# EAGLE design Mug Temperature Sensor (EAGLE 5.11)
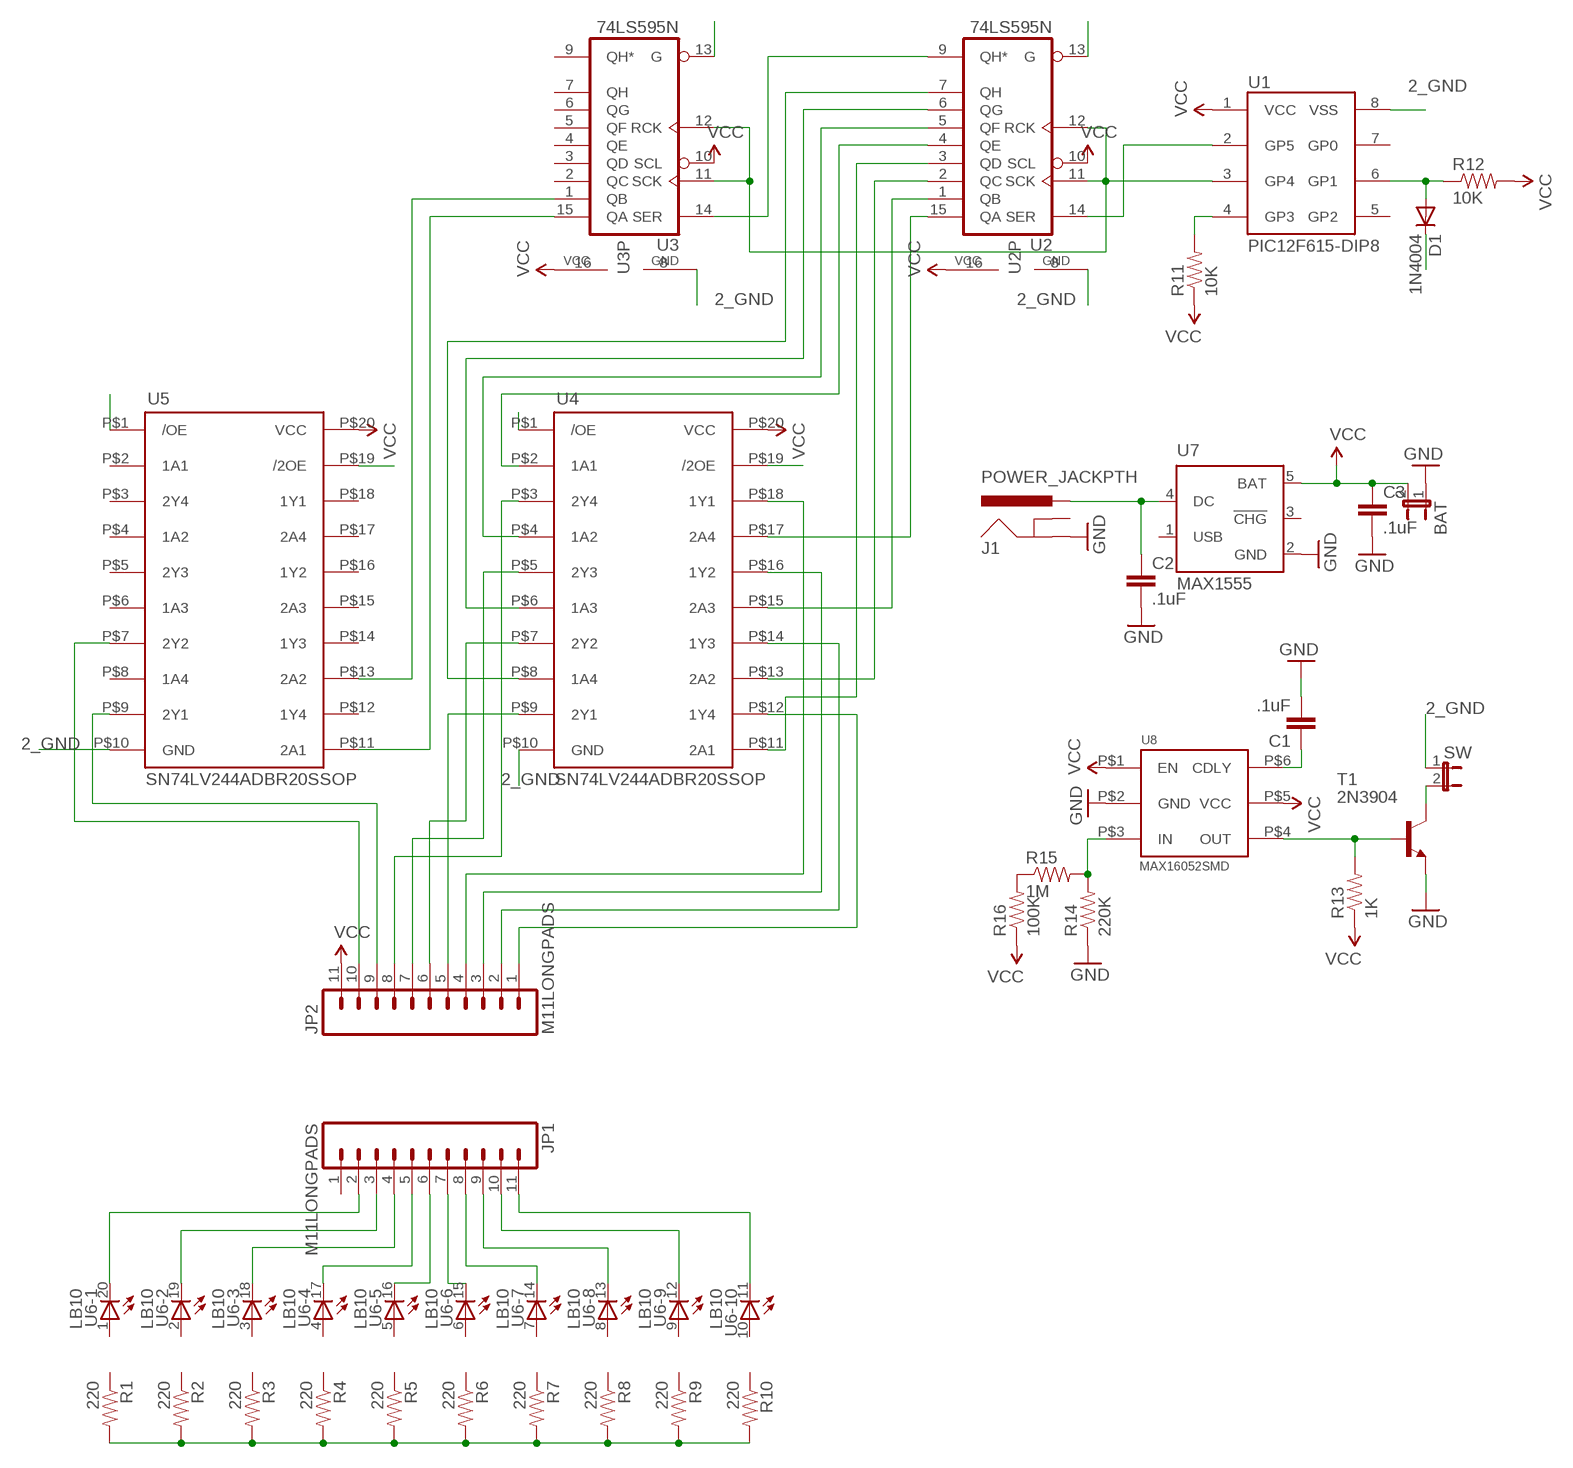
[diagram p0: schematic, sheet 1]

## Parts
BAT  JUMPER-2PTH  [1X02]
C1  .1uF  CAPPTH  [CAP-PTH-SMALL]
C2  .1uF  CAPPTH  [CAP-PTH-SMALL]
C3  .1uF  CAPPTH  [CAP-PTH-SMALL]
D1  1N4004  [DO41-10]
J1  POWER_JACKPTH  [POWER_JACK_PTH]
JP1  M11LONGPADS  [1X11_LONGPADS]
JP2  M11LONGPADS  [1X11_LONGPADS]
R1  220  RESISTORPTH-1/4W  [AXIAL-0.4]
R2  220  RESISTORPTH-1/4W  [AXIAL-0.4]
R3  220  RESISTORPTH-1/4W  [AXIAL-0.4]
R4  220  RESISTORPTH-1/4W  [AXIAL-0.4]
R5  220  RESISTORPTH-1/4W  [AXIAL-0.4]
R6  220  RESISTORPTH-1/4W  [AXIAL-0.4]
R7  220  RESISTORPTH-1/4W  [AXIAL-0.4]
R8  220  RESISTORPTH-1/4W  [AXIAL-0.4]
R9  220  RESISTORPTH-1/4W  [AXIAL-0.4]
R10  220  RESISTORPTH-1/4W  [AXIAL-0.4]
R11  10K  RESISTORPTH-1/4W  [AXIAL-0.4]
R12  10K  RESISTORPTH-1/4W  [AXIAL-0.4]
R13  1K  RESISTORPTH-1/4W  [AXIAL-0.4]
R14  220K  RESISTORPTH-1/4W  [AXIAL-0.4]
R15  1M  RESISTORPTH-1/4W  [AXIAL-0.4]
R16  100K  RESISTORPTH-1/4W  [AXIAL-0.4]
SW  JUMPER-2PTH  [1X02]
T1  2N3904  [TO92]
U1  PIC12F615-DIP8  [DIP-8-300]
U2  74LS595N  [DIL16]
U3  74LS595N  [DIL16]
U4  SN74LV244ADBR20SSOP  [20-SSOP]
U5  SN74LV244ADBR20SSOP  [20-SSOP]
U6  LB10  [LB10]
U7  MAX1555  [SOT23-5L]
U8  MAX16052SMD  [6-SOT23]

## Nets
2_GND: D1.C SW.1 U1.8(VSS) U2.8(GND) U2.13(G) U3.8(GND) U3.13(G) U4.P$1(/OE) U4.P$10(GND) U4.P$19(/2OE) U5.P$1(/OE) U5.P$10(GND) U5.P$19(/2OE)
GND: BAT.1 C1.2 C2.2 C3.2 J1.GND R14.P$1 T1.3(E) U7.2(GND) U8.P$2(GND)
N$1: U1.3(GP4) U2.11(SCK) U2.12(RCK) U3.11(SCK) U3.12(RCK)
N$2: U1.2(GP5) U2.14(SER)
N$3: U2.9(QH*) U3.14(SER)
N$5: U2.15(QA) U4.P$17(2A4)
N$6: U2.1(QB) U4.P$15(2A3)
N$7: U2.2(QC) U4.P$13(2A2)
N$8: U2.3(QD) U4.P$11(2A1)
N$9: U2.4(QE) U4.P$2(1A1)
N$10: U2.5(QF) U4.P$4(1A2)
N$11: U2.6(QG) U4.P$6(1A3)
N$12: U2.7(QH) U4.P$8(1A4)
N$13: U3.15(QA) U5.P$11(2A1)
N$23: JP2.5 U4.P$9(2Y1)
N$24: U3.1(QB) U5.P$13(2A2)
N$25: JP2.6 U4.P$7(2Y2)
N$26: JP2.7 U4.P$5(2Y3)
N$27: JP2.8 U4.P$3(2Y4)
N$28: JP2.4 U4.P$18(1Y1)
N$29: JP2.3 U4.P$16(1Y2)
N$30: JP2.2 U4.P$14(1Y3)
N$31: JP2.1 U4.P$12(1Y4)
N$32: JP2.9 U5.P$9(2Y1)
N$33: JP2.10 U5.P$7(2Y2)
N$34: R11.P$2 U1.4(GP3)
N$35: D1.A R12.P$1 U1.6(GP1)
N$36: C2.1 J1.PWR U7.4(DC)
N$37: R13.P$2 T1.2(B) U8.P$4(OUT)
N$38: C1.1 U8.P$6(CDLY)
N$39: R14.P$2 R15.P$2 U8.P$3(IN)
N$40: R15.P$1 R16.P$2
N$41: SW.2 T1.1(C)
N$42: R1.P$2 R2.P$2 R3.P$2 R4.P$2 R5.P$2 R6.P$2 R7.P$2 R8.P$2 R9.P$2 R10.P$2
N$43: JP1.2 U6.20(-1:C)
N$44: JP1.3 U6.19(-2:C)
N$45: JP1.4 U6.18(-3:C)
N$46: JP1.5 U6.17(-4:C)
N$47: JP1.6 U6.16(-5:C)
N$48: JP1.7 U6.15(-6:C)
N$49: JP1.8 U6.14(-7:C)
N$50: JP1.9 U6.13(-8:C)
N$51: JP1.10 U6.12(-9:C)
N$52: JP1.11 U6.11(-10:C)
VCC: BAT.2 C3.1 JP2.11 R11.P$1 R12.P$2 R13.P$1 R16.P$1 U1.1(VCC) U2.10(SCL) U2.16(VCC) U3.10(SCL) U3.16(VCC) U4.P$20(VCC) U5.P$20(VCC) U7.5(BAT) U8.P$1(EN) U8.P$5(VCC)
Unconnected: J1.GNDBREAK JP1.1 R1.P$1 R2.P$1 R3.P$1 R4.P$1 R5.P$1 R6.P$1 R7.P$1 R8.P$1 R9.P$1 R10.P$1 U1.5(GP2) U1.7(GP0) U3.2(QC) U3.3(QD) U3.4(QE) U3.5(QF) U3.6(QG) U3.7(QH) U3.9(QH*) U5.P$2(1A1) U5.P$3(2Y4) U5.P$4(1A2) U5.P$5(2Y3) U5.P$6(1A3) U5.P$8(1A4) U5.P$12(1Y4) U5.P$14(1Y3) U5.P$15(2A3) U5.P$16(1Y2) U5.P$17(2A4) U5.P$18(1Y1) U6.1(-1:A) U6.2(-2:A) U6.3(-3:A) U6.4(-4:A) U6.5(-5:A) U6.6(-6:A) U6.7(-7:A) U6.8(-8:A) U6.9(-9:A) U6.10(-10:A) U7.1(USB) U7.3(!CHG)

## Library data of the parts
BAT SW = SparkFun:JUMPER-2: Jumper Basic 0.1" spaced jumper. Use with breakaway headers.
C1-C3 = SparkFun:CAP: Capacitor Standard 0603 ceramic capacitor, and 0.1" leaded capacitor.
D1 = diode:1N4004: DIODE general purpose rectifier, 1 A
J1 = SparkFun:POWER_JACK: Power Jack This is the standard 5.5mm barrel jack for power. The PTH is the most common, proven, reliable, footprint. All others are experimental. The Slot footprint only works if the mill layer is transmitted to the PCB fab house so be warned. Spark Fun Electronics SKU : PRT-00119. Mating wall wart : TOL-00298 (and others)
JP1 JP2 = SparkFun:M11: Header 11 Standard 11-pin 0.1" header. Use with straight break away headers (SKU : PRT-00116), right angle break away headers (PRT-00553), swiss pins (PRT-00743), machine pins (PRT-00117), and female headers (PRT-00115).
R1-R16 = SparkFun:RESISTOR: Resistor Basic schematic elements and footprints for 0603, 1206, and PTH resistors.
T1 = transistor:2N3904: NPN TRANSISTOR
U1 = boztalay_custom:PIC12F615
U2 U3 = 74xx-us:74*595: 8-bit SHIFT REGISTER, output latch
U4 U5 = boztalay_custom:SN74LV244ADBR
U6 = led:LB10: LED BLOCK 10-LED bar graph, DIL, Siemens
U7 = maxim:MAX1555: Dual-Input USB/AC Adapter 1-Cell Li+ Battery Chargers Source: http://www.maxim-ic.com .. MAX1551-MAX1555.pdf; MF: MAXIM; MPN: MAX1555EZK+T; OC_FARNELL: 1628222; OC_NEWARK: 59J2761
U8 = boztalay_custom:MAX16052

## Board
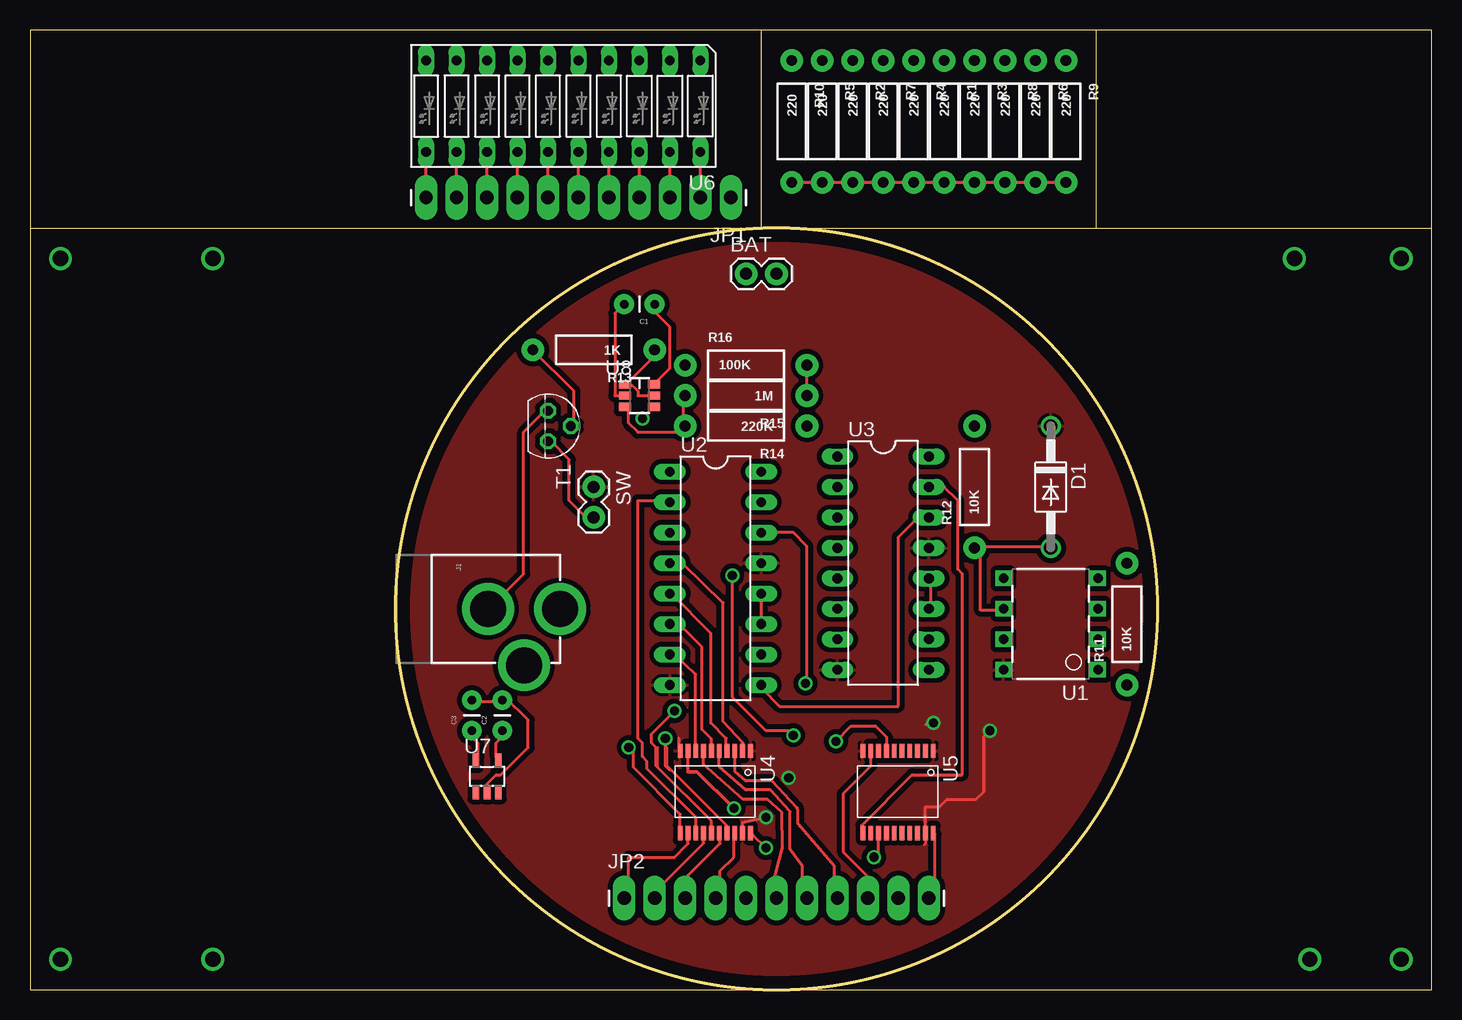
[diagram p1: board, top side]
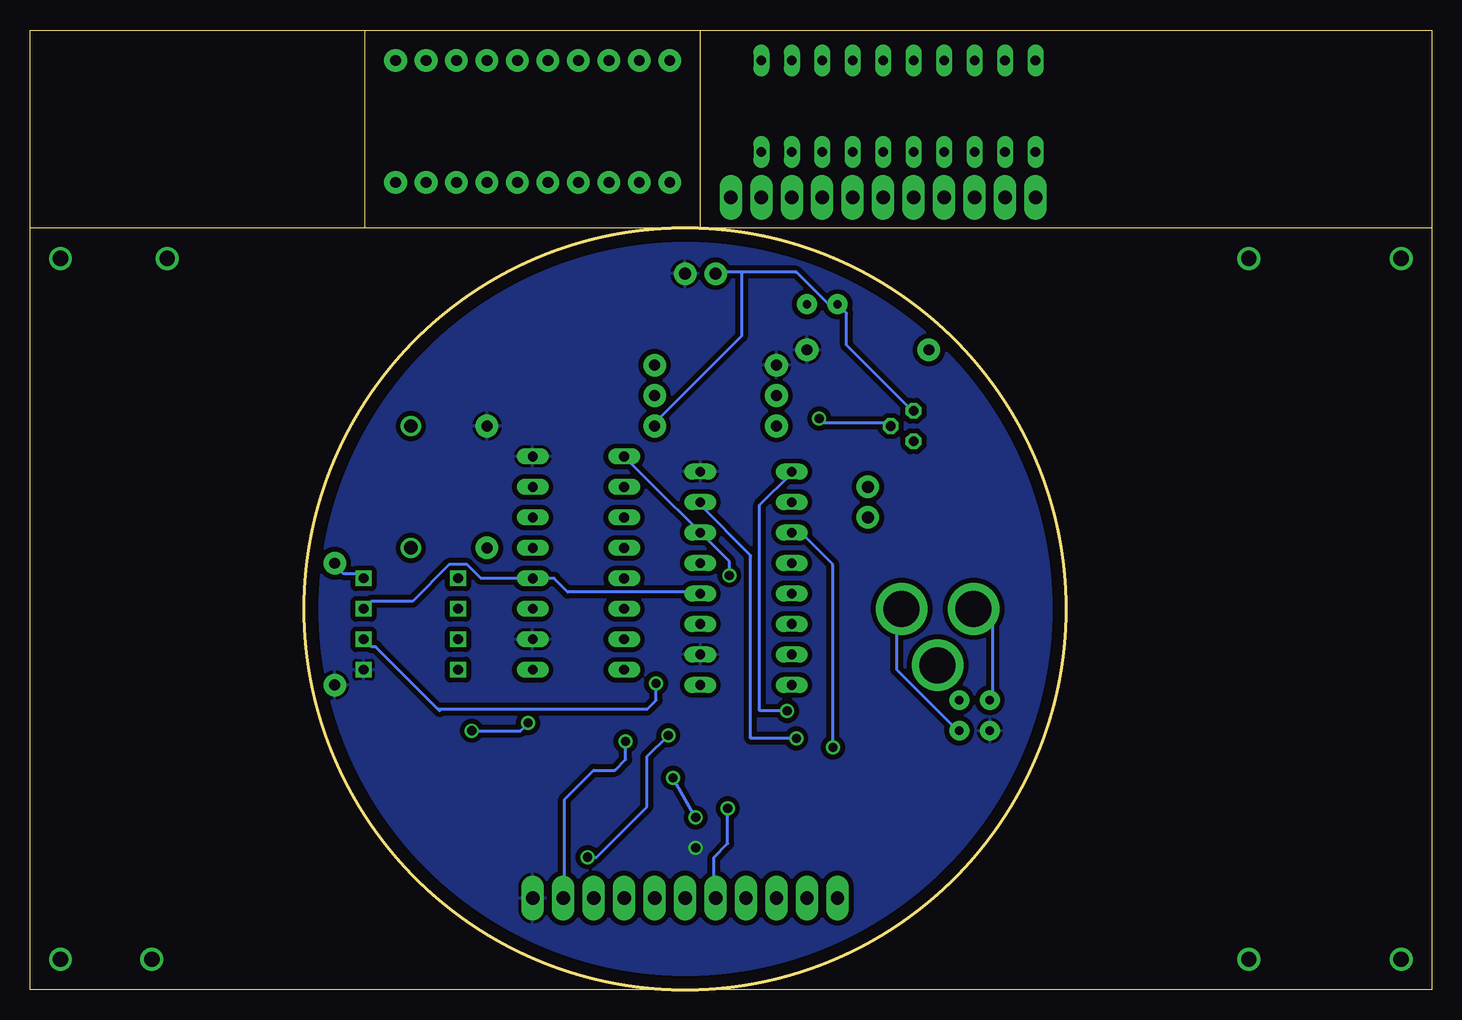
[diagram p2: board, bottom side, seen from below]

Size 116.84 x 80.01 mm. Coordinates in mm from the lower left corner, seen from the top.
Outline: 116.84,63.5 116.84,0 0,0 0,63.5
Outline: 116.84,63.5 116.84,80.01 0,80 0,63.5
Outline: 0,63.5 60.96,63.5
Outline: 60.96,63.5 88.9,63.5
Outline: 88.9,63.5 88.9,80.01
Outline: 60.96,63.5 60.96,80.01
Outline: 88.9,63.5 116.84,63.5
Outline: circle at 62.23,31.75 radius 31.75
Copper layers (1*16): Top 0.035mm / dielectric 1.5mm / Bottom 0.035mm
Design rules "default": minimum track width 10mil, minimum drill 24mil, track to track 8mil, track to pad 8mil, pad to pad 8mil, via to via 8mil, smd to smd 8mil, copper to edge 40mil, drill to drill 8mil, minimum pad ring 10mil, minimum via ring 8mil, stop-mask expansion 4mil, vias tented up to drill 0mil, thermal gap 10mil

### Footprints (pad centres in the part's own frame; a part is rotated, then mirrored left to right if it is on the bottom)
1X02 = drill 1.016 pad 1.88 round: 1 0,0; 2 2.54,0
CAP-PTH-SMALL = drill 0.7 pad 1.651 round: 1 0,0; 2 2.54,0
DO41-10 = drill 1.118 round: A 5.08,0; C -5.08,0
POWER_JACK_PTH = drill 2.997 pad 4.318 round: GND 0,7.7; GNDBREAK 4.7,10.7; PWR 0,13.7
1X11_LONGPADS = drill 1.118 pad 1.88 long: 1 0,0; 2 2.54,0; 3 5.08,0; 4 7.62,0; 5 10.16,0; 6 12.7,0; 7 15.24,0; 8 17.78,0; 9 20.32,0; 10 22.86,0; 11 25.4,0
AXIAL-0.4 = drill 0.9 pad 1.88 round: P$1 -5.08,0; P$2 5.08,0
TO92 = drill 0.813 octagon: 1 1.27,0; 2 0,1.905; 3 -1.27,0
DIP-8-300 = drill 0.8 square: 1 -3.937,3.81; 2 -3.937,1.27; 3 -3.937,-1.27; 4 -3.937,-3.81; 5 3.937,-3.81; 6 3.937,-1.27; 7 3.937,1.27; 8 3.937,3.81
DIL16 = drill 0.813 long: 1 -8.89,-3.81; 2 -6.35,-3.81; 3 -3.81,-3.81; 4 -1.27,-3.81; 5 1.27,-3.81; 6 3.81,-3.81; 7 6.35,-3.81; 8 8.89,-3.81; 9 8.89,3.81; 10 6.35,3.81; 11 3.81,3.81; 12 1.27,3.81; 13 -1.27,3.81; 14 -3.81,3.81; 15 -6.35,3.81; 16 -8.89,3.81
20-SSOP = smd 1.2 x 0.4: P$1 -3.4,2.9; P$2 -3.4,2.25; P$3 -3.4,1.6; P$4 -3.4,0.95; P$5 -3.4,0.3; P$6 -3.4,-0.35; P$7 -3.4,-1; P$8 -3.4,-1.65; P$9 -3.4,-2.3; P$10 -3.4,-2.95; P$11 3.45,-2.95; P$12 3.45,-2.3; P$13 3.45,-1.65; P$14 3.45,-1; P$15 3.45,-0.35; P$16 3.45,0.3; P$17 3.45,0.95; P$18 3.45,1.6; P$19 3.45,2.25; P$20 3.45,2.9
LB10 = drill 0.813 long: 1 -11.43,-3.81; 2 -8.89,-3.81; 3 -6.35,-3.81; 4 -3.81,-3.81; 5 -1.27,-3.81; 6 1.27,-3.81; 7 3.81,-3.81; 8 6.35,-3.81; 9 8.89,-3.81; 10 11.43,-3.81; 11 11.43,3.81; 12 8.89,3.81; 13 6.35,3.81; 14 3.81,3.81; 15 1.27,3.81; 16 -1.27,3.81; 17 -3.81,3.81; 18 -6.35,3.81; 19 -8.89,3.81; 20 -11.43,3.81
SOT23-5L = smd 0.55 x 1.2: 1 -0.95,-1.3; 2 0,-1.3; 3 0.95,-1.3; 4 0.95,1.3; 5 -0.95,1.3
6-SOT23 = smd 1 x 0.7: P$1 -1.2,0.95; P$2 -1.2,0; P$3 -1.2,-0.95; P$4 1.2,-0.95; P$5 1.2,0; P$6 1.2,0.95

### Placement (x,y rotation side)
BAT  59.69,59.69 0 top
C1  52.07,57.15 180 top
C2  39.37,21.59 90 top
C3  36.83,21.59 90 top
D1  85.09,41.91 270 top
J1  30.48,31.75 270 top
JP1  58.42,66.04 180 top
JP2  49.53,7.62 0 top
R1  76.2,72.39 270 top
R2  68.58,72.39 270 top
R3  78.74,72.39 270 top
R4  73.66,72.39 270 top
R5  66.04,72.39 270 top
R6  83.82,72.39 270 top
R7  71.12,72.39 270 top
R8  81.28,72.39 270 top
R9  86.36,72.39 270 top
R10  63.5,72.39 270 top
R11  91.44,30.48 90 top
R12  78.74,41.91 90 top
R13  46.99,53.34 180 top
R14  59.69,46.99 180 top
R15  59.69,49.53 180 top
R16  59.69,52.07 0 top
SW  46.99,41.91 270 top
T1  43.18,46.99 270 top
U1  85.09,30.48 180 top
U2  57.15,34.29 270 top
U3  71.12,35.56 270 top
U4  57.15,16.51 270 top
U5  72.39,16.51 270 top
U6  44.45,73.66 180 top
U7  38.1,17.78 0 top
U8  50.8,49.53 0 top

### Tracks (layer width: path | path; a pad name or v marks a point on that pad's centre or on a via)
2_GND  (via drill 0.76)
  Top 0.254: 59.44,12.95 U4.P$19 59.4,13.93 v61.34,14.35 | 74.56,12.08 74.68,12.19 74.68,12.95 U5.P$19 74.64,15.2 74.68,15.24 75.82,15.24 76.45,15.88 78.87,15.88 79.5,16.51 79.5,21.08 v80.01,21.59 | 54.1,20.95 54.1,20.19 U4.P$10 | v75.31,22.23 74.8,22.23 74.68,22.1 | v63.25,17.65 63.37,17.65 63.5,17.78 63.37,17.78 v63.25,17.65
  Bottom 0.254: v61.34,14.35 v63.25,17.65 | v80.01,21.59 75.95,21.59 v75.31,22.23
  pour Top (isolate 0.406): 30.48,63.5 93.98,63.5 93.98,0 30.48,0
GND
  Top 0.254: U7.2 38.1,17.14 38.86,17.91 39.24,17.91 41.53,20.19 41.53,22.48 39.62,24.38 C2.2 39.24,24 36.96,24 C3.2 | C1.2 48.77,56.39 48.77,49.53 U8.P$2 | J1.GND 38.48,32 41.15,34.67 41.15,46.48 43.05,48.39 T1.3
  Bottom 0.254: C3.2 36.58,24.38 36.58,31.62 38.1,31.62 J1.GND | T1.3 43.43,48.39 48.77,53.72 48.77,56.39 C1.2 50.29,57.15 52.96,59.82 57.53,59.82 | 57.53,59.82 59.44,59.82 BAT.1 | 57.53,59.82 57.53,54.48 64.77,47.24 R14.P$1
N$1
  Top 0.254: U2.11 U2.12 | U3.11 75.06,32 75.06,34.29 U3.12
  Bottom 0.254: U1.3 88.39,32.38 84.96,32.38 81.92,35.43 80.39,35.43 79.25,34.29 U3.12 73.15,34.29 72.01,33.15 60.96,33.15 U2.12
N$2  (via drill 0.76)
  Top 0.254: U2.14 63.63,38.1 64.77,36.96 64.77,25.65 v64.64,25.53
  Bottom 0.254: 82.8,23.37 82.68,23.24 | U1.2 88.39,28.57 88.01,28.57 82.8,23.37 | v64.64,25.53 64.64,24.13 65.41,23.37 82.8,23.37
N$3
  Top 0.254: U2.9 60.96,25.15 62.48,23.62 72.39,23.62 72.39,37.72 73.91,39.24 74.68,39.24 U3.14
N$4  (via drill 1.27)
  other vias: 2.54,2.54
N$5  (via drill 0.76)
  Top 0.254: U4.P$17 58.1,13.65 53.4,18.35 | 53.4,18.35 53.09,18.67 53.09,20.19 | v52.96,20.95 52.96,18.67 53.34,18.29 53.4,18.35
  Bottom 0.254: v52.96,20.95 56.77,20.95 56.77,36.2 60.96,40.39 U2.15
N$6  (via drill 0.76)
  Top 0.254: U4.P$15 56.8,14.07 52.32,18.54 | 52.32,18.54 52.32,20.19 | v53.72,23.24 51.82,21.34 51.82,20.57 52.2,20.19 52.2,18.67 52.32,18.54
  Bottom 0.254: v53.72,23.24 56.01,23.24 56.01,40.39 53.34,43.05 U2.1
N$7
  Top 0.254: U4.P$13 55.5,14.35 51.44,18.41 51.44,19.05 51.05,19.43 51.05,20.57 50.67,20.95 50.67,40.77 53.34,40.77 U2.2
N$8  (via drill 0.76)
  Top 0.254: U4.P$11 54.2,14.63 50.29,18.54 50.29,19.81 | 50.29,19.81 50.29,20.07 | 50.29,19.81 v49.91,20.19
  Bottom 0.254: U2.3 52.96,37.72 52.2,37.72 49.91,35.43 v49.91,20.19
N$9
  Top 0.254: U4.P$2 59.44,20.19 59.44,20.57 57.78,22.35 57.78,32.26 54.48,35.43 53.34,35.43 U2.4
N$10
  Top 0.254: 58.04,20.07 58.04,19.94 58.07,19.91 U4.P$4 58.04,19.97 58.04,20.95 56.77,22.23 56.77,29.72 53.47,33.02 U2.5
N$11
  Top 0.254: U2.6 54.1,30.48 56.01,28.57 56.01,21.72 56.8,20.92 U4.P$6
N$12
  Top 0.254: U2.7 53.72,27.94 55.5,26.29 U4.P$8
N$13
  Top 0.254: U5.P$11 69.34,13.34 69.34,13.72 73.53,17.91 77.72,17.91 77.72,34.67 77.34,35.05 77.34,40.77 76.2,41.91 U3.15
N$14  (via drill 1.27)
  other vias: 114.3,2.54
N$15  (via drill 1.27)
  other vias: 114.3,60.96
N$16  (via drill 1.27)
  other vias: 2.54,60.96
N$17  (via drill 1.27)
  other vias: 105.41,60.96
N$18  (via drill 1.27)
  other vias: 106.68,2.54
N$19  (via drill 1.27)
  other vias: 15.24,60.96
N$20  (via drill 1.27)
  other vias: 15.24,2.54
N$23  (via drill 0.76)
  Top 0.254: 54.85,18.18 U4.P$9
  Top 0.305: 54.85,18.18 55.61,18.18 v58.67,15.11
  Bottom 0.254: v58.67,15.11 58.67,12.19 59.82,11.05 59.82,7.62 JP2.5
N$24  (via drill 0.76)
  Top 0.254: U5.P$13 70.74,11.43 v70.36,11.05 | v63.63,21.21 63.25,21.59 61.34,21.59 58.55,24.38 v58.55,34.54
  Bottom 0.254: v70.36,11.05 69.6,11.05 65.41,15.24 65.41,19.43 v63.63,21.21 | v58.55,34.54 58.55,35.69 U3.1
N$25
  Top 0.254: U4.P$7 56.15,18.78 59.44,15.88 61.47,15.88 62.67,14.8 62.74,11.81 61.72,8 62.1,7.62 JP2.6
N$26
  Top 0.254: U4.P$5 57.45,18.62 59.69,16.64 61.72,16.64 63.37,14.86 63.37,11.68 64.39,10.29 64.39,8 JP2.7
N$27
  Top 0.254: U4.P$3 58.75,18.21 59.69,17.4 61.85,17.4 63.94,15.18 64.01,14.99 64.01,13.84 67.06,10.29 67.06,7.62 JP2.8
N$28
  Top 0.254: JP2.4 57.53,8 57.53,9.91 58.67,11.05 58.67,12.95 U4.P$18
N$29
  Top 0.254: U4.P$16 57.53,12.95 57.53,12.19 54.86,9.53 54.86,7.62 JP2.3
N$30
  Top 0.254: U4.P$14 56.15,12.21 52.07,8.13 JP2.2
N$31
  Top 0.254: JP2.1 49.91,8 49.91,11.05 53.72,11.05 54.86,12.19 54.86,12.95 U4.P$12
N$32
  Top 0.254: U5.P$9 70.1,19.81 70.1,18.67 67.82,16.38 67.82,11.43 70.1,9.14 70.1,7.62 JP2.9
N$33  (via drill 0.76)
  Top 0.254: U5.P$7 71.39,21.07 70.48,21.97 68.45,21.97 v67.18,20.7
  Bottom 0.254: v67.18,20.7 67.18,19.18 68.07,18.29 69.85,18.29 72.26,15.88 72.26,7.75 JP2.10
N$34
  Bottom 0.254: U1.4 89.15,34.29 89.53,34.67 90.68,34.67 91.44,35.43 R11.P$2
N$35
  Top 0.254: U1.6 81.15,31.62 79.25,31.62 79.25,36.2 78.87,36.58 R12.P$1 78.87,36.96 84.96,36.96 D1.A
N$36
  Top 0.254: U7.4 38.86,19.43 38.86,20.57 39.24,20.95 39.24,21.34 C2.1
  Bottom 0.254: C2.1 39.62,21.72 44.58,26.67 44.58,31.62 44.2,31.62 J1.PWR
N$37  (via drill 0.76)
  Top 0.254: v51.05,47.62 51.82,48.39 U8.P$4 | R13.P$2 45.34,49.91 45.34,47.24 T1.2
  Bottom 0.254: v51.05,47.62 50.67,47.24 45.34,47.24 T1.2
N$38
  Top 0.254: U8.P$6 52.2,50.67 53.34,51.82 53.34,55.24 52.2,56.39 52.2,57.15 C1.1
N$39
  Top 0.254: U8.P$3 49.91,48.39 49.91,47.24 50.67,46.48 54.48,46.48 54.48,46.86 R14.P$2 54.48,47.24 54.48,49.53 R15.P$2
N$40
  Top 0.254: R15.P$1 R16.P$2
N$41
  Top 0.254: T1.1 43.43,45.72 44.96,44.2 44.96,40.77 46.1,39.62 46.86,39.62 SW.2
N$42
  Top 0.254: R10.P$2 R5.P$2 R2.P$2 R7.P$2 R4.P$2 R1.P$2 R3.P$2 R8.P$2 R6.P$2 R9.P$2
N$43
  Top 0.254: JP1.2 U6.20
N$44
  Top 0.254: JP1.3 U6.19
N$45
  Top 0.254: JP1.4 U6.18
N$46
  Top 0.254: JP1.5 U6.17
N$47
  Top 0.254: JP1.6 U6.16
N$48
  Top 0.254: JP1.7 U6.15
N$49
  Top 0.254: JP1.8 U6.14
N$50
  Top 0.254: JP1.9 U6.13
N$51
  Top 0.254: JP1.10 U6.12
N$52
  Top 0.254: JP1.11 U6.11
VCC  (via drill 0.76)
  Top 0.254: 49.91,50.67 51.82,52.58 51.82,53.34 R13.P$1 | 49.91,50.67 50.67,49.91 50.67,49.53 U8.P$5 | U8.P$1 49.91,50.67 | v61.34,11.81 60.2,12.95 U4.P$20 | U5.P$20 75.44,12.95 75.44,8 75.06,7.62 JP2.11 | U7.5 37.34,19.43 37.34,20.57 36.96,20.95 36.96,21.34 C3.1
  pour Bottom (isolate 0.406): 30.48,63.5 93.98,63.5 93.98,0 30.48,0